# EAGLE design PineWoodDerby_Mega_Shield (EAGLE 7.2.0)
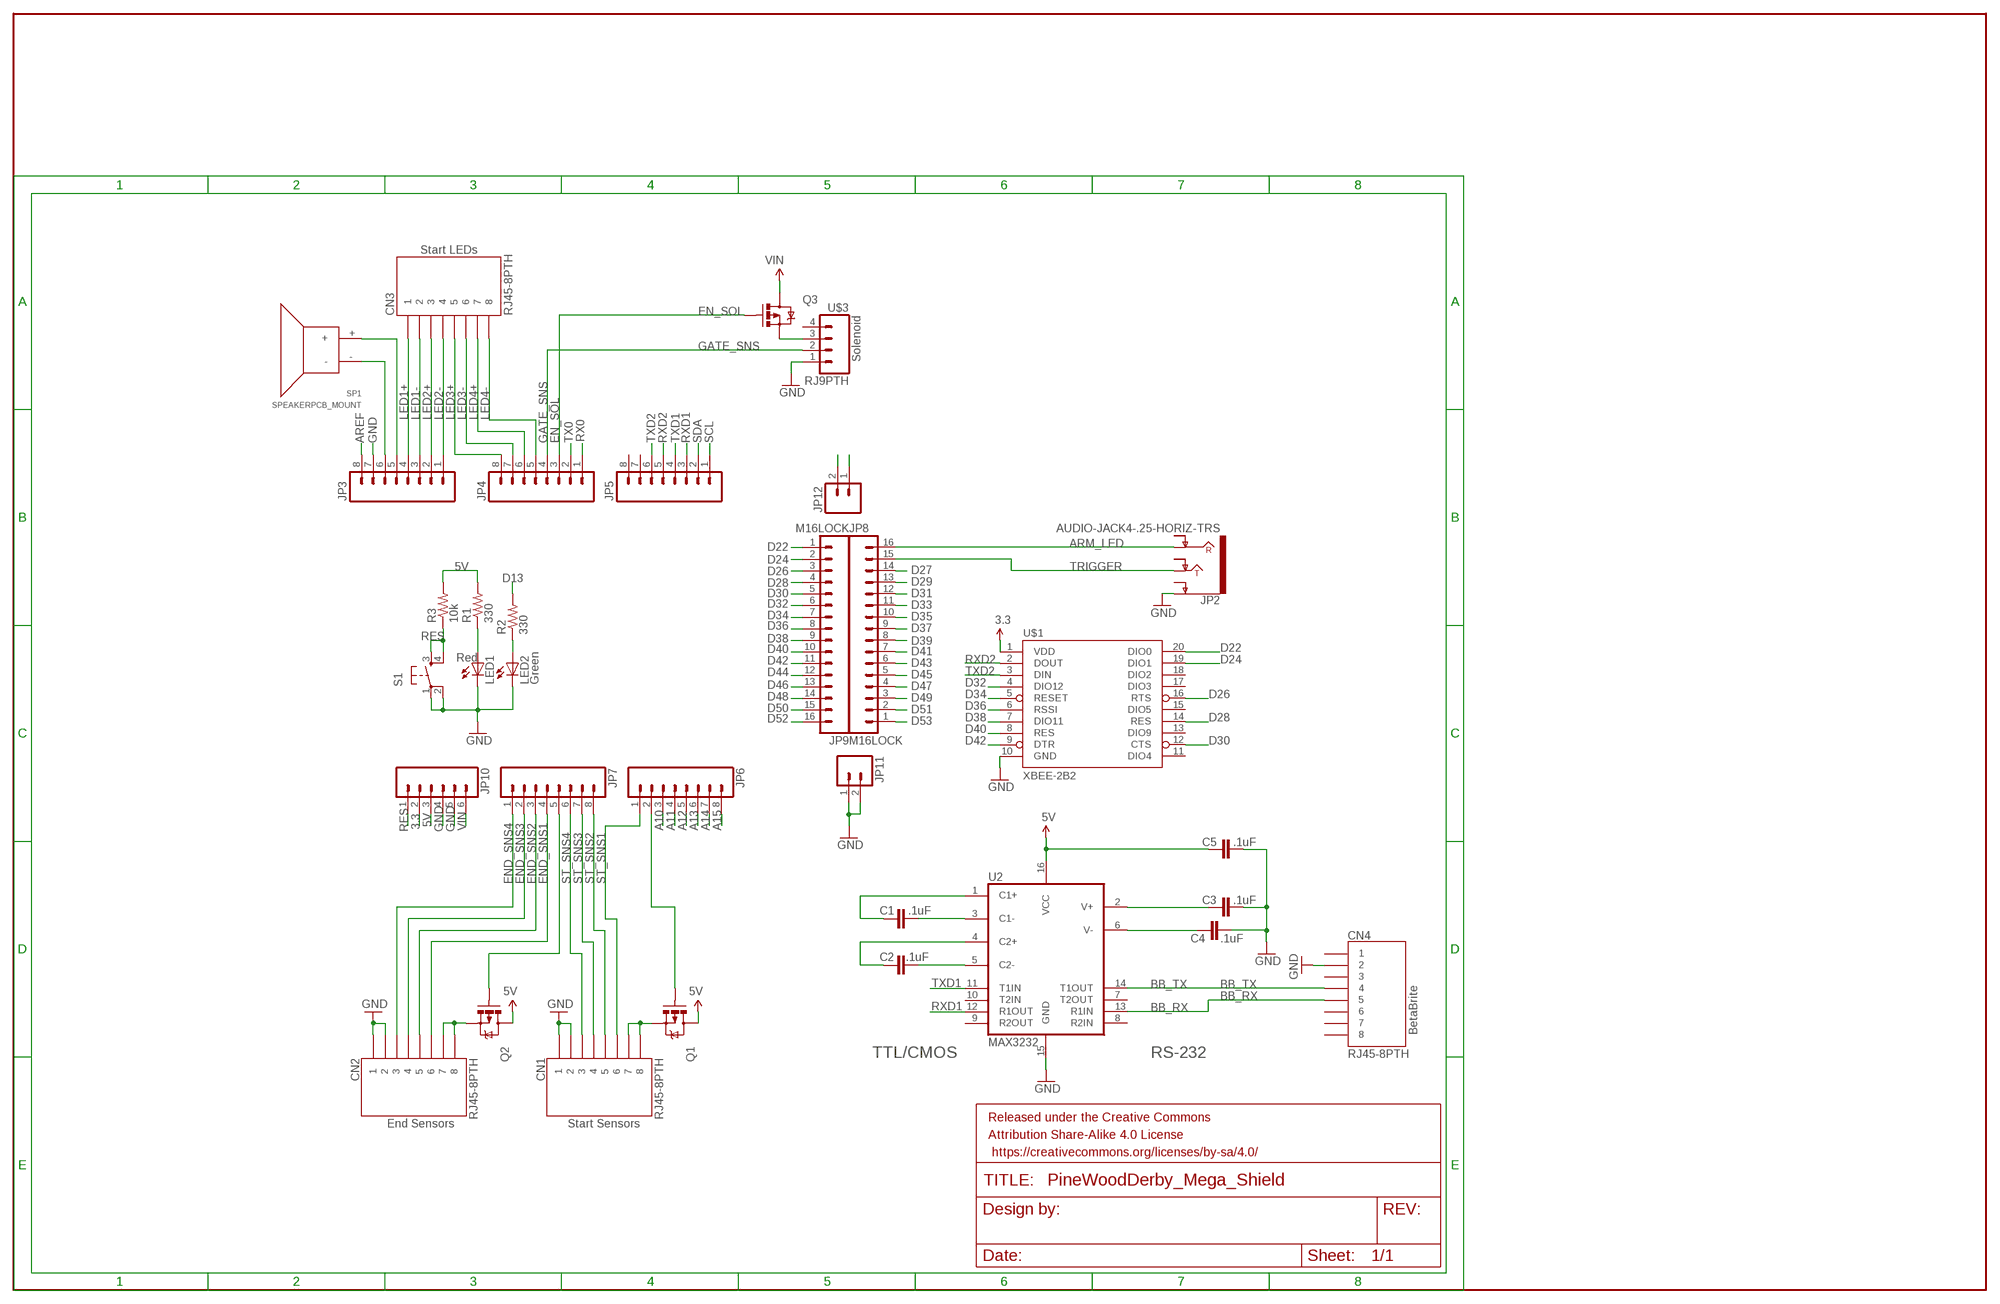
[diagram p0: schematic, sheet 1]

## Parts
C1  .1uF  CAP0402-CAP  [0402-CAP]
C2  .1uF  CAP0402-CAP  [0402-CAP]
C3  .1uF  CAP0402-CAP  [0402-CAP]
C4  .1uF  CAP0402-CAP  [0402-CAP]
C5  .1uF  CAP0402-CAP  [0402-CAP]
CN1  RJ45-8PTH  [RJ45-8]
CN2  RJ45-8PTH  [RJ45-8]
CN3  RJ45-8PTH  [RJ45-8]
CN4  RJ45-8PTH  [RJ45-8]
FRAME2  FRAME-LEDGER  [CREATIVE_COMMONS]
JP2  AUDIO-JACK4-.25-HORIZ-TRS  [AUDIO-JACK-.25-INCH-HORIZ-PTH]
JP3  M08LOCK  [1X08_LOCK]
JP4  M08LOCK  [1X08_LOCK]
JP5  M08LOCK  [1X08_LOCK]
JP6  M08LOCK  [1X08_LOCK]
JP7  M08LOCK  [1X08_LOCK]
JP8  M16LOCK  [1X16_LOCK]
JP9  M16LOCK  [1X16_LOCK]
JP10  M06LOCK  [1X06_LOCK]
JP11  M02LOCK  [1X02_LOCK]
JP12  M02LOCK  [1X02_LOCK]
LED1  Red  LED5MM  [LED5MM]
LED2  Green  LED5MM  [LED5MM]
Q1  MOSFET-PCHANNELFQP27P06  [TO220V]
Q2  MOSFET-PCHANNELFQP27P06  [TO220V]
Q3  MOSFET-PCHANNELFQP27P06  [TO220V]
R1  330  RESISTORPTH1  [AXIAL-0.3]
R2  330  RESISTORPTH1  [AXIAL-0.3]
R3  10k  RESISTORPTH1  [AXIAL-0.3]
S1  TAC_SWITCHPTH  [TACTILE-PTH]
SP1  SPEAKERPCB_MOUNT  [PCB_MOUNT_SPEAKER]
U2  MAX3232  MAX232SOIC16  [SO016]
U$1  XBEE-2B2  [XBEE-SILK]
U$3  RJ9PTH  [RJ9]

## Nets
3.3: JP10.2 U$1.1(VDD)
5V: C5.1 JP10.3 Q1.2(D) Q2.2(D) R1.P$2 R3.P$2 U2.16(VCC)
5V@1: JP12.1 JP12.2
A10: JP6.3
A11: JP6.4
A12: JP6.5
A13: JP6.6
A14: JP6.7
A15: JP6.8
AREF: JP3.8
ARM_LED: JP2.RING JP8.16
BB_RX: CN4.5 U2.13(R1IN)
BB_TX: CN4.4 U2.14(T1OUT)
C1+: C1.1 U2.1(C1+)
C1-: C1.2 U2.3(C1-)
C2+: C2.1 U2.4(C2+)
C2-: C2.2 U2.5(C2-)
D13: R2.P$2
D22: JP9.1 U$1.20(DIO0)
D24: JP9.2 U$1.19(DIO1)
D26: JP9.3 U$1.16(RTS)
D27: JP8.14
D28: JP9.4 U$1.14(RES)
D29: JP8.13
D30: JP9.5 U$1.12(CTS)
D31: JP8.12
D32: JP9.6 U$1.4(DIO12)
D33: JP8.11
D34: JP9.7 U$1.5(RESET)
D35: JP8.10
D36: JP9.8 U$1.6(RSSI)
D37: JP8.9
D38: JP9.9 U$1.7(DIO11)
D39: JP8.8
D40: JP9.10 U$1.8(RES)
D41: JP8.7
D42: JP9.11 U$1.9(DTR)
D43: JP8.6
D44: JP9.12
D45: JP8.5
D46: JP9.13
D47: JP8.4
D48: JP9.14
D49: JP8.3
D50: JP9.15
D51: JP8.2
D52: JP9.16
D53: JP8.1
EN_END_SNS: JP7.5 Q2.1(G)
EN_SOL: JP4.3 Q3.1(G)
EN_ST_SNS: JP6.2 Q1.1(G)
END_SNS1: CN2.6 JP7.4
END_SNS2: CN2.5 JP7.3
END_SNS3: CN2.4 JP7.2
END_SNS4: CN2.3 JP7.1
GATE_SNS: JP4.4 U$3.2
GND: C3.2 C4.2 C5.2 CN1.1 CN1.2 CN2.1 CN2.2 CN4.2 JP2.SLEEVE(EARTH) JP3.7 JP10.4 JP10.5 JP11.1 JP11.2 LED1.K(C) LED2.K(C) S1.1 S1.2 U2.15(GND) U$1.10(GND) U$3.1
LED1+: CN3.1 JP3.4
LED1-: CN3.2 JP3.3
LED2+: CN3.3 JP3.2
LED2-: CN3.4 JP3.1
LED3+: CN3.5 JP4.8
LED3-: CN3.6 JP4.7
LED4+: CN3.7 JP4.6
LED4-: CN3.8 JP4.5
N$1: JP3.5 SP1.+
N$2: JP3.6 SP1.-
N$11: CN2.7 CN2.8 Q2.3(S)
N$12: CN1.7 CN1.8 Q1.3(S)
N$60: Q3.3(S) U$3.3
N$126: LED1.A R1.P$1
N$127: LED2.A R2.P$1
RES: JP10.1 R3.P$1 S1.3 S1.4
RX0: JP4.1
RXD1: JP5.3 U2.12(R1OUT)
RXD2: JP5.5 U$1.2(DOUT)
SCL: JP5.1
SDA: JP5.2
ST_SNS1: CN1.6 JP6.1
ST_SNS2: CN1.5 JP7.8
ST_SNS3: CN1.4 JP7.7
ST_SNS4: CN1.3 JP7.6
TRIGGER: JP2.TIP JP8.15
TX0: JP4.2
TXD1: JP5.4 U2.11(T1IN)
TXD2: JP5.6 U$1.3(DIN)
V+: C3.1 U2.2(V+)
V-: C4.1 U2.6(V-)
VIN: JP10.6 Q3.2(D)
Unconnected: CN4.1 CN4.3 CN4.6 CN4.7 CN4.8 JP2.RING-NORM JP2.SLEEVE-NORM(EARTH-NORM) JP2.TIP-NORM JP5.7 JP5.8 U2.7(T2OUT) U2.8(R2IN) U2.9(R2OUT) U2.10(T2IN) U$1.11(DIO4) U$1.13(DIO9) U$1.15(DIO5) U$1.17(DIO3) U$1.18(DIO2) U$3.4

## Notes on the sheet
- TTL/CMOS | RS-232

## Library data of the parts
C1-C5 = SparkFun-Passives:CAP: Capacitor Standard 0603 ceramic capacitor, and 0.1" leaded capacitor.; PROD_ID: CAP-00810; SPARKLE_ID: 918
CN1 = SparkFun-Connectors:RJ45-8: RJ45 Jack Simple RJ45, 8-pin connection - connector for common Cat5, Cat5e, and Cat6 Ethernet cables. Footprint not yet proven in production. Connector sku is PRT-00643; Breakout PCB sku is BOB-00716.; LABEL: Start Sensors
CN2 = SparkFun-Connectors:RJ45-8: RJ45 Jack Simple RJ45, 8-pin connection - connector for common Cat5, Cat5e, and Cat6 Ethernet cables. Footprint not yet proven in production. Connector sku is PRT-00643; Breakout PCB sku is BOB-00716.; LABEL: End Sensors
CN3 = SparkFun-Connectors:RJ45-8: RJ45 Jack Simple RJ45, 8-pin connection - connector for common Cat5, Cat5e, and Cat6 Ethernet cables. Footprint not yet proven in production. Connector sku is PRT-00643; Breakout PCB sku is BOB-00716.; LABEL: Start LEDs
CN4 = SparkFun-Connectors:RJ45-8: RJ45 Jack Simple RJ45, 8-pin connection - connector for common Cat5, Cat5e, and Cat6 Ethernet cables. Footprint not yet proven in production. Connector sku is PRT-00643; Breakout PCB sku is BOB-00716.; LABEL: BetaBrite
FRAME2 = SparkFun-Aesthetics:FRAME-LEDGER: Schematic Frame Standard 11x14 US Ledger frame
JP2 = SparkFun-Connectors:AUDIO-JACK4-.25-HORIZ-TRS: 1/4" TRS jack, horizontal Production SKU: COM-11144 Footprint unproven - datasheet and part seem to be slightly different; PROD_ID: COM-11144
JP3-JP7 = SparkFun:M08: Header 8 Standard 8-pin 0.1" header. Use with straight break away headers (SKU : PRT-00116), right angle break away headers (PRT-00553), swiss pins (PRT-00743), machine pins (PRT-00117), and female headers (PRT-00115).
JP8 JP9 = SparkFun:M16
JP10 = SparkFun:M06: Header 6 Standard 6-pin 0.1" header. Use with straight break away headers (SKU : PRT-00116), right angle break away headers (PRT-00553), swiss pins (PRT-00743), machine pins (PRT-00117), and female headers (PRT-00115). Molex polarized connector foot print use with SKU : PRT-08094 with associated crimp pins and housings. NOTES ON THE VARIANTS LOCK and LOCK_LONGPADS... This footprint was designed to help hold the alignment of a through-hole component (i.e. 6-pin header) while soldering it into place. You may notice that each hole has been shifted either up or down by 0.005 of an inch from it's more standard position (which is a perfectly straight line). This slight alteration caused the pins (the squares in the middle) to touch the edges of the holes. Because they are alternating, it causes a "brace" to hold the component in place. 0.005 has proven to be the perfect amount of "off-center" position when using our standard breakaway headers. Although looks a little odd when you look at the bare footprint, once you have a header in there, the alteration is very hard to notice. Also, if you push a header all the way into place, it is covered up entirely on the bottom side. This idea of altering the position of holes to aid alignment will be further integrated into the Sparkfun Library for other footprints. It can help hold any component with 3 or more connection pins.
JP11 JP12 = SparkFun:M02: Header 2 Standard 2-pin 0.1" header. Use with straight break away headers (SKU : PRT-00116), right angle break away headers (PRT-00553), swiss pins (PRT-00743), machine pins (PRT-00117), and female headers (PRT-00115). Molex polarized connector foot print use with SKU : PRT-08233 with associated crimp pins and housings.
LED1 LED2 = SparkFun:LED: LEDs Standard schematic elements and footprints for 5mm, 3mm, 1206, and 0603 sized LEDs. 5mm - Spark Fun Electronics SKU : COM-00529 (and others)
Q1-Q3 = SparkFun-DiscreteSemi:MOSFET-PCHANNEL: Generic PMOSFET IRLML2244 - TRANS-11153 (SOT-23 -20V -4.3A) (1.Gate 2.Source 3.Drain) FQP27P06 - COM-10349 <http://www.sparkfun.com/products/10349> (TO-220 -60V -27A) (1.Gate 2.Source 3.Drain)
R1-R3 = SparkFun:RESISTOR: Resistor Basic schematic elements and footprints for 0603, 1206, and PTH 1/10th watt (small) resistors.
S1 = SparkFun:TAC_SWITCH: Momentary Switch Button commonly used for reset or general input. Spark Fun Electronics SKU : COM-00097
SP1 = SparkFun-Electromechanical:SPEAKER: General speakers.; MFG: SANCO; PROD_#: NA; SKU: COM-11089; SPARKLE_ID: 6504
U2 = SparkFun-DigitalIC:MAX232: RS232 Transceiver Very common IC. This is generically called 'MAX232', but works with the 3V equivalent MAX3232 generic ICs. Field tested and mother approved. Spark Fun Electronics SKU : COM-00316 (DIP) and COM-00589 (SMD); PROD_ID: IC-08171
U$1 = SparkFun-RF:XBEE-2: Xbee module footprints SMT header is CONN-09042.
U$3 = SparkFun-Connectors:RJ9: RJ9 connector (e.g., phone handsets); LABEL: Solenoid

## Net classes
0 default: width 0.203 mm

## Board
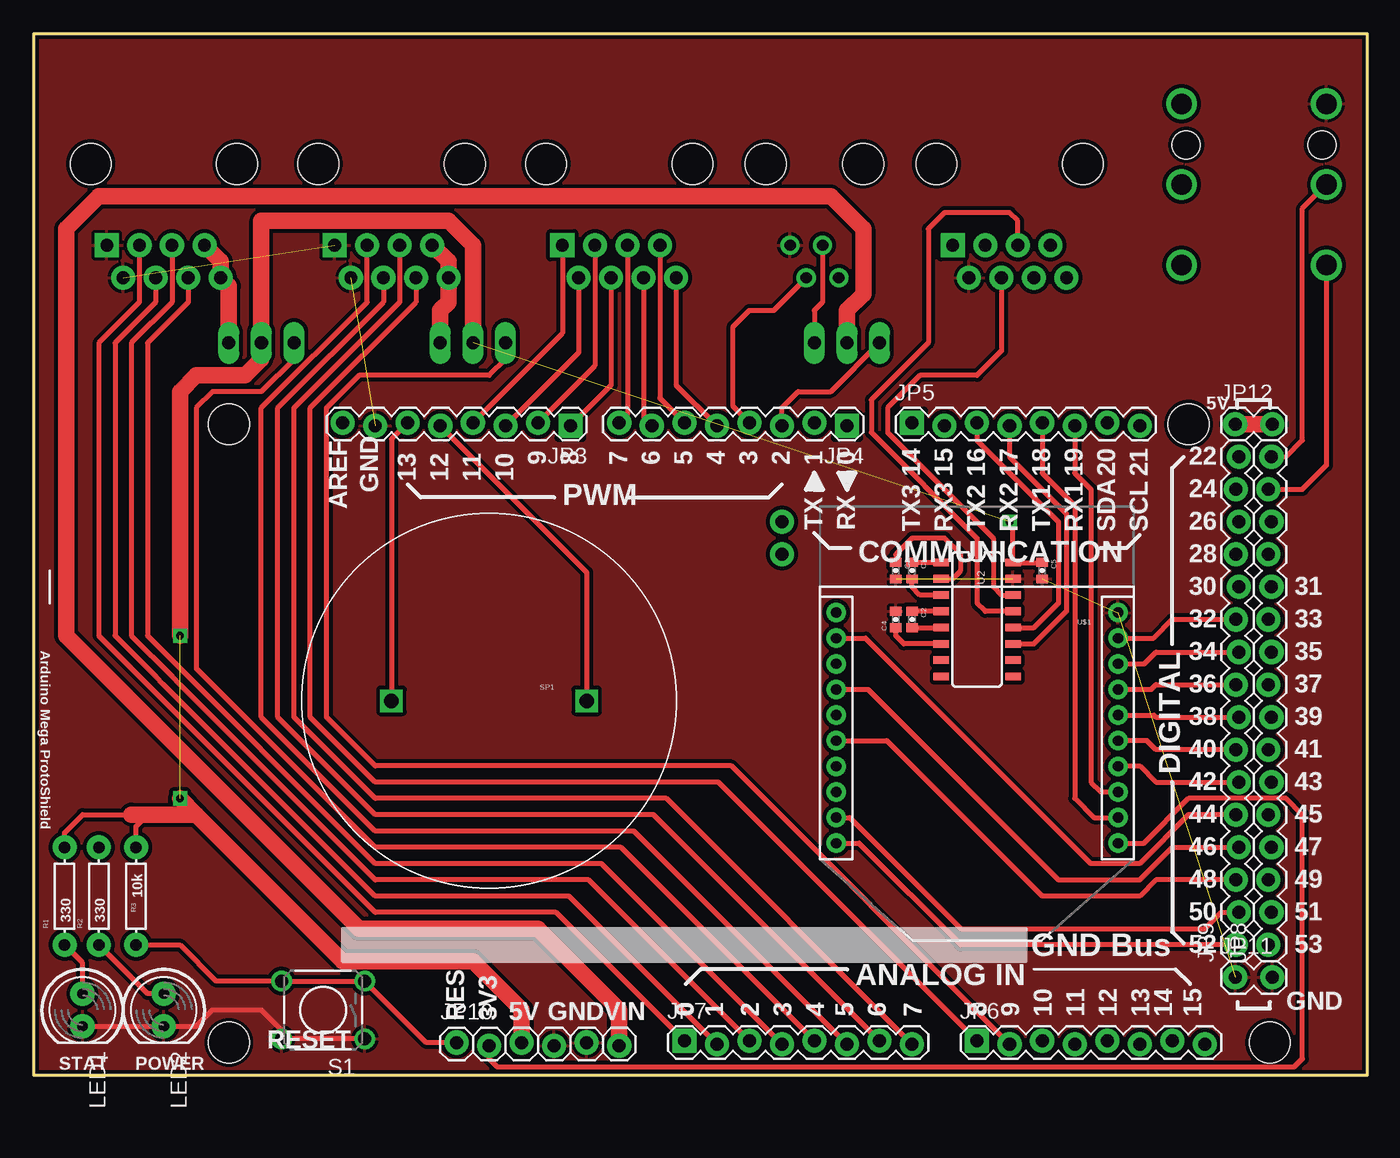
[diagram p1: board, top side]
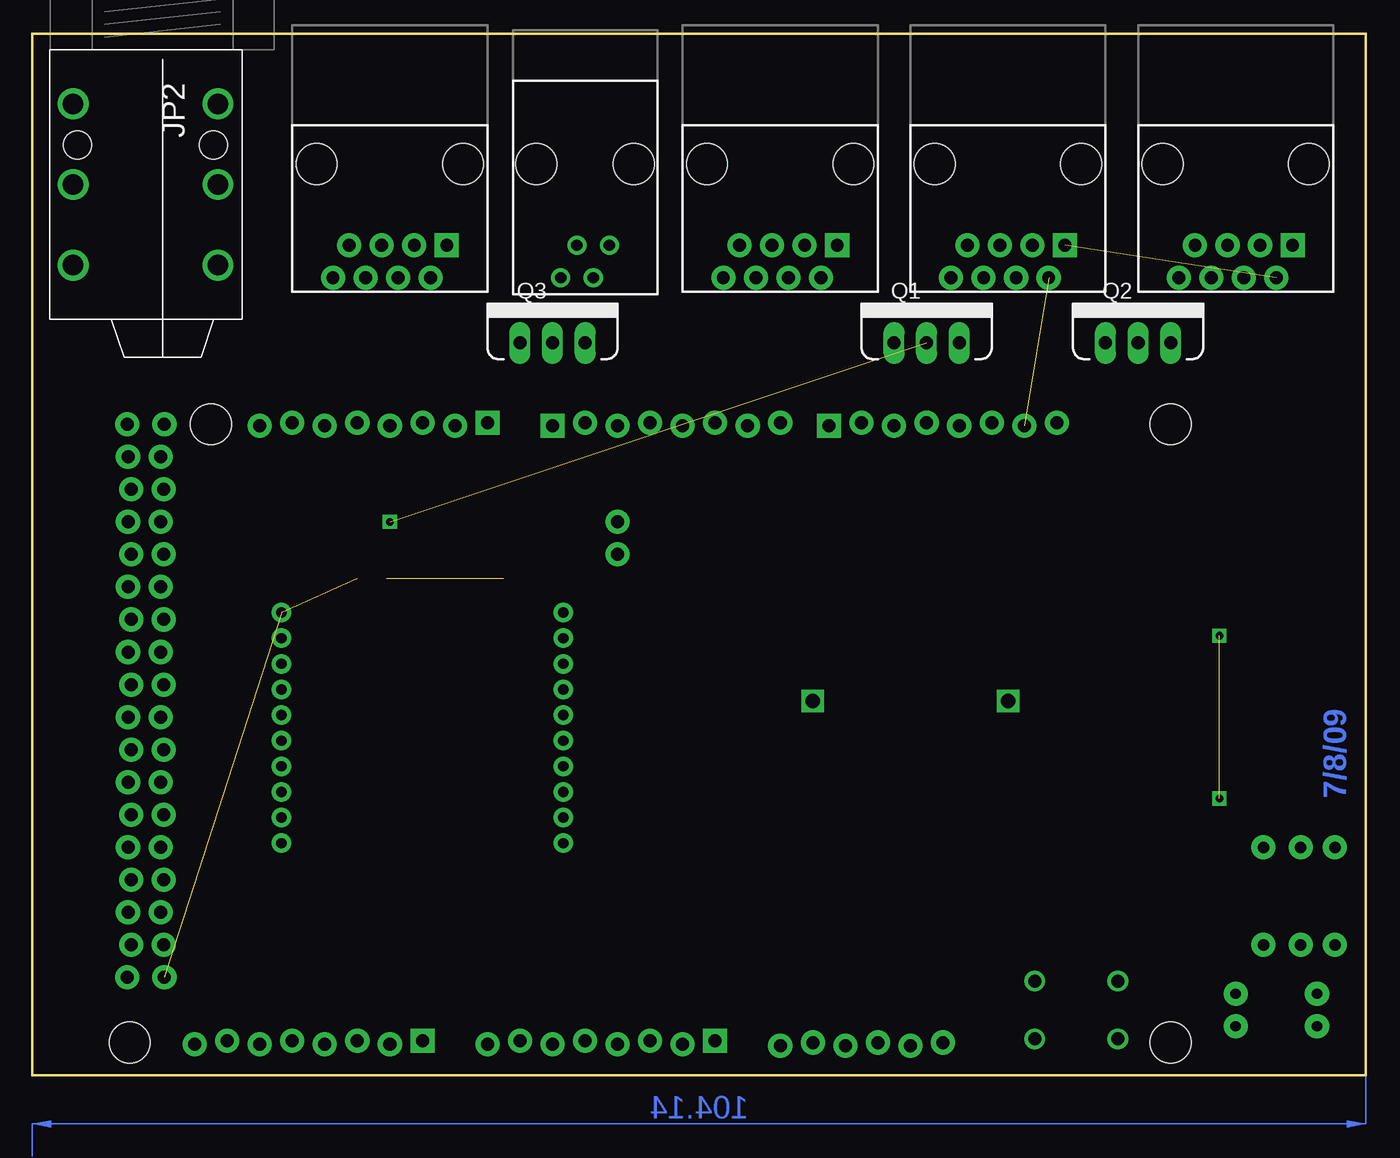
[diagram p2: board, bottom side, seen from below]

Size 104.14 x 81.28 mm. Coordinates in mm from the lower left corner, seen from the top.
Outline: 0,0 104.14,0 104.14,81.28 0,81.28 0,0
Copper layers (1*16): Top 0.035mm / dielectric 1.5mm / Bottom 0.035mm
Design rules "SparkFun": minimum track width 8mil, minimum drill 20mil, track to track 8mil, track to pad 8mil, pad to pad 8mil, via to via 8mil, smd to smd 8mil, copper to edge 10mil, drill to drill 8mil, minimum pad ring 12mil, minimum via ring 10mil, stop-mask expansion 4mil, vias tented up to drill 25mil, thermal gap 10mil
Holes 3.2 mm at 15.24,50.8 15.24,2.54 90.17,50.8 96.52,2.54

### Footprints (pad centres in the part's own frame; a part is rotated, then mirrored left to right if it is on the bottom)
0402-CAP = smd 0.7 x 0.9: 1 -0.65,0; 2 0.65,0
RJ45-8 = drill 1 pad 1.88 square: 1 -4.445,6.35 | drill 1 pad 1.88: 2 -3.175,8.89; 3 -1.905,6.35; 4 -0.635,8.89; 5 0.635,6.35; 6 1.905,8.89; 7 3.175,6.35; 8 4.445,8.89 | hole 3.2: -5.715,0; 5.715,0
AUDIO-JACK-.25-INCH-HORIZ-PTH = drill 1.6: RING 10.5,-6.95; RING-NORM 10.5,4.35; SLEEVE 4.2,-6.95; SLEEVE-NORM 4.2,4.35; TIP 16.8,-6.95; TIP-NORM 16.8,4.35 | hole 2.2: 7.4,4; 7.4,-6.6
1X08_LOCK = drill 1.016 pad 1.88 square: 1 0,0.127 | drill 1.016 pad 1.88: 2 2.54,-0.127; 3 5.08,0.127; 4 7.62,-0.127; 5 10.16,0.127; 6 12.7,-0.127; 7 15.24,0.127; 8 17.78,-0.127
1X16_LOCK = drill 1.016 pad 1.88: 1 0,0.127; 2 2.54,-0.127; 3 5.08,0.127; 4 7.62,-0.127; 5 10.16,0.127; 6 12.7,-0.127; 7 15.24,0.127; 8 17.78,-0.127; 9 20.32,0.127; 10 22.86,-0.127; 11 25.4,0.127; 12 27.94,-0.127; 13 30.48,0.127; 14 33.02,-0.127; 15 35.56,0.127; 16 38.1,-0.127
1X06_LOCK = drill 1.016 pad 1.88: 1 0,0; 2 2.54,-0.254; 3 5.08,0; 4 7.62,-0.254; 5 10.16,0; 6 12.7,-0.254
1X02_LOCK = drill 1.016 pad 1.88: 1 -0.178,0; 2 2.718,0
LED5MM = drill 0.813 pad 1.88: A -1.27,0; K 1.27,0
TO220V = drill 1.016 long: 1 -2.54,0; 2 0,0; 3 2.54,0
AXIAL-0.3 = drill 0.9 pad 1.88: P$1 -3.81,0; P$2 3.81,0
TACTILE-PTH = drill 1.016: 1 -3.251,2.261; 2 3.251,2.261; 3 -3.251,-2.261; 4 3.251,-2.261
PCB_MOUNT_SPEAKER = drill 1.143 square: + -7.62,0; - 7.62,0
SO016 = smd 0.6 x 1.2: 1 -4.445,-2.8; 2 -3.175,-2.8; 3 -1.905,-2.8; 4 -0.635,-2.8; 5 0.635,-2.8; 6 1.905,-2.8; 7 3.175,-2.8; 8 4.445,-2.8; 9 4.445,2.8; 10 3.175,2.8; 11 1.905,2.8; 12 0.635,2.8; 13 -0.635,2.8; 14 -1.905,2.8; 15 -3.175,2.8; 16 -4.445,2.8
XBEE-SILK = drill 0.8 pad 1.524: 1 -11,20; 2 -11,18; 3 -11,16; 4 -11,14; 5 -11,12; 6 -11,10; 7 -11,8; 8 -11,6; 9 -11,4; 10 -11,2; 11 11,2; 12 11,4; 13 11,6; 14 11,8; 15 11,10; 16 11,12; 17 11,14; 18 11,16; 19 11,18; 20 11,20
RJ9 = drill 0.889: 1 -1.905,6.35; 2 -0.635,8.89; 3 0.635,6.35; 4 1.905,8.89 | hole 3.2: -3.81,0; 3.81,0

### Placement (x,y rotation side)
C1  68.58,39.37 270 top
C2  68.58,35.56 270 top
C3  67.31,39.37 270 top
C4  67.31,35.56 90 top
C5  78.74,39.37 270 top
CN1  27.94,71.12 180 bottom
CN2  10.16,71.12 180 bottom
CN3  45.72,71.12 180 bottom
CN4  76.2,71.12 180 bottom
FRAME2  17.78,-17.78 0 top  (outside the outline)
JP2  93.98,80.01 270 bottom
JP3  41.91,50.8 180 top
JP4  63.5,50.8 180 top
JP5  68.58,50.8 0 top
JP6  73.66,2.54 0 top
JP7  50.8,2.54 0 top
JP8  96.52,10.16 90 top
JP9  93.98,10.16 90 top
JP10  33.02,2.54 0 top
JP11  93.98,7.62 0 top
JP12  93.98,50.8 0 top
LED1  3.81,5.08 270 top
LED2  10.16,5.08 270 top
Q1  34.29,57.15 0 bottom
Q2  17.78,57.15 0 bottom
Q3  63.5,57.15 0 bottom
R1  2.41,13.97 90 top
R2  5.08,13.97 90 top
R3  8,13.97 90 top
S1  22.61,5.08 180 top
SP1  35.56,29.21 180 top
U2  73.66,35.56 270 top
U$1  73.66,38.1 180 top
U$3  60.96,71.12 180 bottom

### Tracks (layer width: path | path; a pad name or v marks a point on that pad's centre or on a via)
3.3
  Top 0.406: U$1.1 86.68,18.1 90.17,21.59 97.79,21.59 99.06,20.32 99.06,1.27 98.42,0.64 36.2,0.64 35.56,1.27 JP10.2 35.56,2.54
5V  (via drill 0.6)  (2 unrouted)
  Top 0.406: C5.1 78.72,40.01 U2.16 76.46,42.92 v76.2,43.18 | R1.P$2 2.41,18.92 3.81,20.32 7.62,20.32 8.89,20.32 8,19.43 R3.P$2
  Top 1.27: Q1.2 34.29,64.77 32.38,66.67 17.78,66.67 Q2.2 17.78,55.88 16.51,54.61 12.7,54.61 11.43,53.34 v11.43,34.29 | JP10.3 38.1,5.08 34.29,8.89 24.13,8.89 12.7,20.32 | 12.7,20.32 v11.43,21.59 | 7.62,20.32 12.7,20.32
5V@1
  Top 1.27: JP12.1 JP12.2
A10
  Top 0.203: JP6.3 78.74,2.54
A11
  Top 0.203: JP6.4 81.28,2.54 JP6.4
A12
  Top 0.203: JP6.5 83.82,2.54
A13
  Top 0.203: JP6.6 86.36,2.54 JP6.6
A14
  Top 0.203: JP6.7 88.9,2.54
A15
  Top 0.203: JP6.8 91.44,2.54 JP6.8
AREF
  Top 0.203: JP3.8 24.13,50.8 JP3.8
ARM_LED
  Top 0.406: JP8.16 97.79,48.26 99.06,49.53 99.06,67.64 JP2.RING
BB_RX
  Top 0.406: CN4.5 76.83,66.67 76.2,67.31 71.12,67.31 69.85,66.04 69.85,57.15 65.41,52.7 65.41,50.16 73.66,41.91 73.66,36.83 74.3,36.2 U2.13
BB_TX
  Top 0.406: CN4.4 75.56,56.52 73.66,54.61 69.22,54.61 66.67,52.07 66.67,50.16 74.93,41.91 74.93,38.1 75.56,37.47 U2.14
C1+
  Top 0.406: U2.1 68.59,40.01 C1.1
C1-
  Top 0.406: U2.3 69.22,37.47 68.58,38.1 C1.2
C2+
  Top 0.406: U2.4 68.59,36.2 C2.1
C2-
  Top 0.406: C2.2 70.84,34.91 U2.5
D22
  Top 0.406: JP9.1 72.39,10.16 64.45,18.1 U$1.20
D24
  Top 0.406: U$1.19 63.72,20.1 72.39,11.43 91.44,11.43 92.71,12.7 JP9.2
D26
  Top 0.406: JP9.3 87.63,15.24 86.36,13.97 78.74,13.97 66.61,26.1 U$1.16
D28
  Top 0.406: U$1.14 65.15,30.1 80.01,15.24 86.36,15.24 88.9,17.78 JP9.4
D30
  Top 0.406: JP9.5 90.17,20.32 86.36,16.51 82.55,16.51 64.96,34.1 U$1.12
D32
  Top 0.406: U$1.4 84.69,24.13 86.36,24.13 87.63,22.86 JP9.6
D34
  Top 0.406: JP9.7 87.63,25.4 86.93,26.1 U$1.5
D36
  Top 0.406: U$1.6 87.47,28.1 87.63,27.94 JP9.8
D38
  Top 0.406: U$1.7 87.25,30.1 87.63,30.48 JP9.9
D40
  Top 0.406: U$1.8 86.71,32.1 87.63,33.02 JP9.10
D42
  Top 0.406: U$1.9 87.44,34.1 88.9,35.56 JP9.11
EN_END_SNS
  Top 0.406: JP7.5 45.85,17.78 26.67,17.78 12.7,31.75 12.7,52.07 13.97,53.34 17.78,53.34 20.32,55.88 Q2.1
EN_SOL
  Top 0.406: JP4.3 58.42,52.07 59.69,53.34 62.23,53.34 Q3.1
EN_ST_SNS
  Top 0.406: JP6.2 54.48,24.13 26.67,24.13 22.86,27.94 22.86,52.07 25.4,54.61 35.56,54.61 36.83,55.88 Q1.1
END_SNS1
  Top 0.406: JP7.4 44.32,16.51 26.67,16.51 8.89,34.29 8.89,57.15 12.06,60.33 CN2.6
END_SNS2
  Top 0.406: JP7.3 43.31,15.24 26.67,15.24 11.43,30.48 10.79,31.11 7.62,34.29 7.62,57.15 10.79,60.33 CN2.5
END_SNS3
  Top 0.406: JP7.2 41.78,13.97 26.67,13.97 10.16,30.48 9.53,31.11 6.35,34.29 6.35,57.15 9.53,60.33 CN2.4
END_SNS4
  Top 0.406: JP7.1 40.77,12.7 26.67,12.7 5.08,34.29 5.08,57.15 8.26,60.33 CN2.3
GATE_SNS
  Top 0.406: JP4.4 54.61,52.2 54.61,58.42 55.88,59.69 57.78,59.69 U$3.2
GND  (5 unrouted)
  Top 0.406: LED1.K LED2.K 12.7,3.81 13.97,5.08 17.78,5.08 19.36,3.5 S1.2 S1.1
  pour Bottom (isolate 0.305): 0,0 104.14,0 104.14,-20.32 0,-20.32
  pour Top (isolate 0.305): 0,0 104.14,0 104.14,81.28 0,81.28
LED1+
  Top 0.406: JP3.4 41.27,57.91 CN3.1
LED1-
  Top 0.406: JP3.3 42.55,56.39 CN3.2
LED2+
  Top 0.406: JP3.2 43.81,55.37 CN3.3
LED2-
  Top 0.406: JP3.1 45.09,53.85 CN3.4
LED3+
  Top 0.406: JP4.8 46.35,51.56 CN3.5
LED3-
  Top 0.406: JP4.7 47.62,51.31 CN3.6
LED4+
  Top 0.406: JP4.6 48.9,52.83 CN3.7
LED4-
  Top 0.406: JP4.5 50.16,53.85 CN3.8
N$1
  Top 0.406: JP3.5 43.18,39.24 SP1.+
N$2
  Top 0.406: JP3.6 27.94,49.66 SP1.-
N$11
  Top 1.27: Q2.3 15.24,61.59 CN2.8 14.61,63.5 CN2.7
N$12
  Top 1.27: Q1.3 31.75,59.69 32.38,60.33 CN1.8 32.38,63.5 CN1.7
N$60
  Top 0.406: U$3.3 61.59,60.33 60.96,59.69 Q3.3
N$126
  Top 0.406: LED1.A 3.81,8.76 R1.P$1
N$127
  Top 0.406: LED2.A 8.89,6.35 R2.P$1
N$136  (via drill 1.02 pad 1.88)
  other vias: 58.42,43.18
N$137  (via drill 1.02 pad 1.88)
  other vias: 58.42,40.64
RES
  Top 0.406: R3.P$1 11.43,10.16 14.25,7.34 S1.4 S1.3 30.66,2.54 JP10.1
RX0
  Top 0.203: JP4.1 63.5,50.8
RXD1
  Top 0.406: JP5.3 73.66,49.53 80.01,43.18 80.01,36.83 78.11,34.92 U2.12
RXD2
  Top 0.203: JP5.5 78.74,50.8
  Top 0.406: 78.74,50.8 78.74,46.99 81.28,44.45 81.28,21.59 82.77,20.1 U$1.2
SCL
  Top 0.203: JP5.1 68.58,50.8 JP5.1
ST_SNS1
  Top 0.406: JP6.1 53.47,22.86 26.67,22.86 21.59,27.94 21.59,52.07 29.84,60.33 CN1.6
ST_SNS2
  Top 0.406: JP7.8 49.4,21.59 26.67,21.59 20.32,27.94 20.32,52.07 28.57,60.33 CN1.5
ST_SNS3
  Top 0.406: JP7.7 48.39,20.32 26.67,20.32 19.05,27.94 19.05,52.07 27.3,60.33 CN1.4
ST_SNS4
  Top 0.406: JP7.6 46.86,19.05 26.67,19.05 17.78,27.94 17.78,52.07 26.04,60.33 CN1.3
TRIGGER
  Top 0.406: JP2.TIP 100.93,47.59 99.06,45.72 JP8.15
TX0
  Top 0.203: JP4.2 60.96,50.8 JP4.2
TXD1
  Top 0.203: JP5.4 76.2,50.8
  Top 0.406: JP5.4 76.2,48.26 80.64,43.81 80.64,36.2 78.11,33.66 U2.11
TXD2
  Top 0.203: JP5.6 81.28,50.8
  Top 0.406: JP5.6 81.28,46.99 82.55,45.72 82.55,22.86 83.31,22.1 U$1.3
V+
  Top 0.406: 70.84,38.75 U2.2 71.75,38.73 72.39,39.37 72.39,40.64 71.12,41.91 68.58,41.91 67.31,40.64 C3.1
V-
  Top 0.406: U2.6 67.94,33.66 67.31,34.29 C4.1
VIN
  Top 1.27: JP10.6 45.72,5.08 39.37,11.43 25.4,11.43 2.54,34.29 2.54,66.04 5.08,68.58 62.23,68.58 64.77,66.04 64.77,60.96 63.5,59.69 Q3.2
(copper drawn outside any net)
  shapes: Bottom area x2

### Text on the board
Bottom: 7/8/09
tPlace: 5V | 9 | 8 | 7 | 6 | 5 | 4 | 3 | 2 | 1 | 0 | 22 | 14 | 15 | 16 | 17 | 18 | 19 | 20 | 21 | 13 | 12 | 11 | 10 | GND | 24 | AREF | PWM | TX | RX | 26 | TX3 | RX3 | TX2 | RX2 | TX1 | RX1 | SDA | SCL | COMMUNICATION | 28 | 30 | 31 | 32 | 33 | Arduino Mega ProtoShield | 34 | 35 | 36 | 37 | 38 | 39 | 40 | 41 | DIGITAL | 42 | 43 | 44 | 45 | 46 | 47 | 48 | 49 | 50 | 51 | 52 | 53 | GND Bus | ANALOG IN | 0 | 1 | 2 | 3 | 4 | 5 | 6 | 7 | 8 | 9 | 10 | 11 | 12 | 13 | 14 | 15 | GND | RES | 3V3 | 5V | GND | VIN | RESET | STAT | POWER